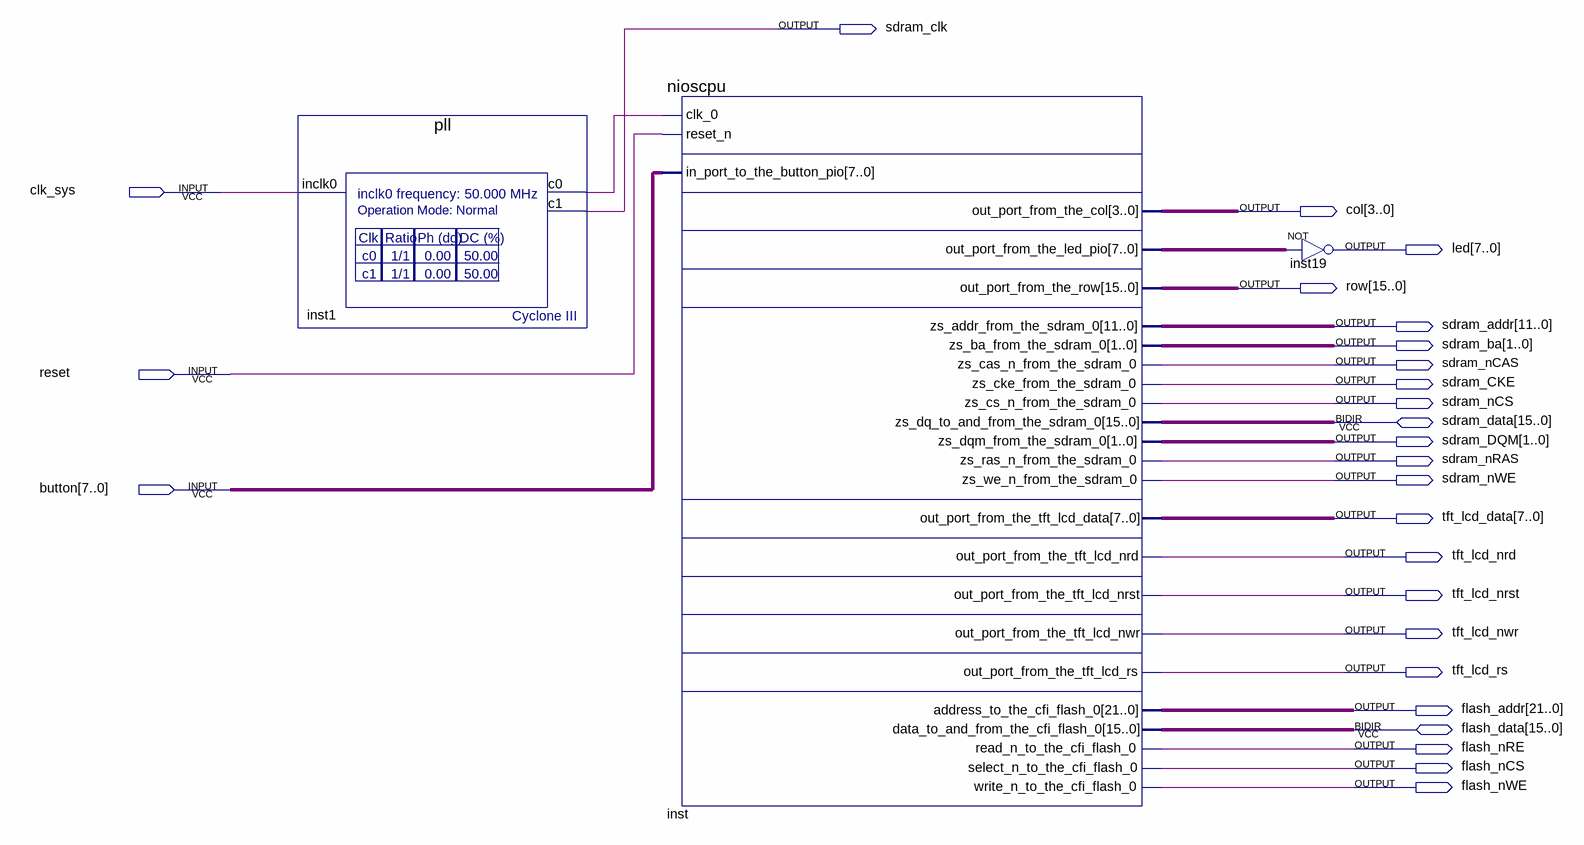
[diagram p0: schematic sheet]
// Quartus schematic clock.bdf as structural Verilog: 3 symbols, 26 pins
module clock (
  input  clk_sys,
  input  reset,
  input  [7:0] button,
  inout  [15:0] sdram_data,
  inout  [15:0] flash_data,
  output sdram_clk,
  output [3:0] col,
  output [7:0] led,
  output [15:0] row,
  output [11:0] sdram_addr,
  output [1:0] sdram_ba,
  output sdram_nCAS,
  output sdram_CKE,
  output sdram_nCS,
  output [1:0] sdram_DQM,
  output sdram_nRAS,
  output sdram_nWE,
  output [7:0] tft_lcd_data,
  output tft_lcd_nrd,
  output tft_lcd_nrst,
  output tft_lcd_nwr,
  output tft_lcd_rs,
  output [21:0] flash_addr,
  output flash_nRE,
  output flash_nCS,
  output flash_nWE
);

  wire inst1_c0;
  wire [7:0] inst_out_port_from_the_led_pio;

  pll inst1 (.inclk0(clk_sys), .c0(inst1_c0), .c1(sdram_clk));
  nioscpu inst (
    .clk_0(inst1_c0), .reset_n(reset), .in_port_to_the_button_pio(button), .out_port_from_the_col(col),
    .out_port_from_the_led_pio(inst_out_port_from_the_led_pio), .out_port_from_the_row(row),
    .zs_addr_from_the_sdram_0(sdram_addr), .zs_ba_from_the_sdram_0(sdram_ba),
    .zs_cas_n_from_the_sdram_0(sdram_nCAS), .zs_cke_from_the_sdram_0(sdram_CKE),
    .zs_cs_n_from_the_sdram_0(sdram_nCS), .zs_dqm_from_the_sdram_0(sdram_DQM),
    .zs_ras_n_from_the_sdram_0(sdram_nRAS), .zs_we_n_from_the_sdram_0(sdram_nWE),
    .out_port_from_the_tft_lcd_data(tft_lcd_data), .out_port_from_the_tft_lcd_nrd(tft_lcd_nrd),
    .out_port_from_the_tft_lcd_nrst(tft_lcd_nrst), .out_port_from_the_tft_lcd_nwr(tft_lcd_nwr),
    .out_port_from_the_tft_lcd_rs(tft_lcd_rs), .address_to_the_cfi_flash_0(flash_addr),
    .read_n_to_the_cfi_flash_0(flash_nRE), .select_n_to_the_cfi_flash_0(flash_nCS),
    .write_n_to_the_cfi_flash_0(flash_nWE), .zs_dq_to_and_from_the_sdram_0(sdram_data),
    .data_to_and_from_the_cfi_flash_0(flash_data));
  assign led = ~inst_out_port_from_the_led_pio;  // NOT inst19, 8 bits wide
endmodule
